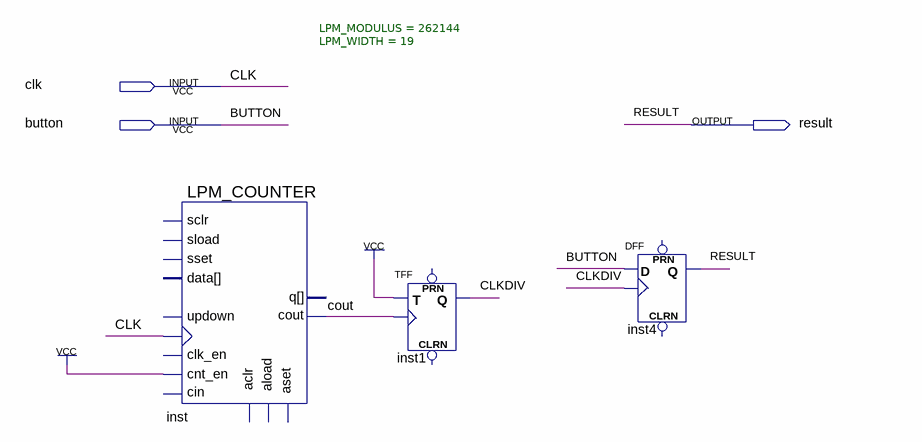
[diagram p0: schematic sheet]
// Quartus schematic debounce.bdf as structural Verilog: 3 symbols, 3 pins
module debounce (
  input  clk,
  input  button,
  output result
);

  wire CLKDIV, cout;

  LPM_COUNTER #(.LPM_MODULUS(262144), .LPM_WIDTH(19)) inst (
    .clock(clk), .cnt_en(1'b1), .cout(cout));  // open: sload, data, clk_en, aload, aclr, aset, cin, sset, updown, sclr, q
  TFF inst1 (.T(1'b1), .CLK(cout), .Q(CLKDIV));  // open: PRN, CLRN
  DFF inst4 (.CLK(CLKDIV), .D(button), .Q(result));  // open: CLRN, PRN
endmodule
